# EAGLE design FORCE_SENSOR (EAGLE 7.1.0)
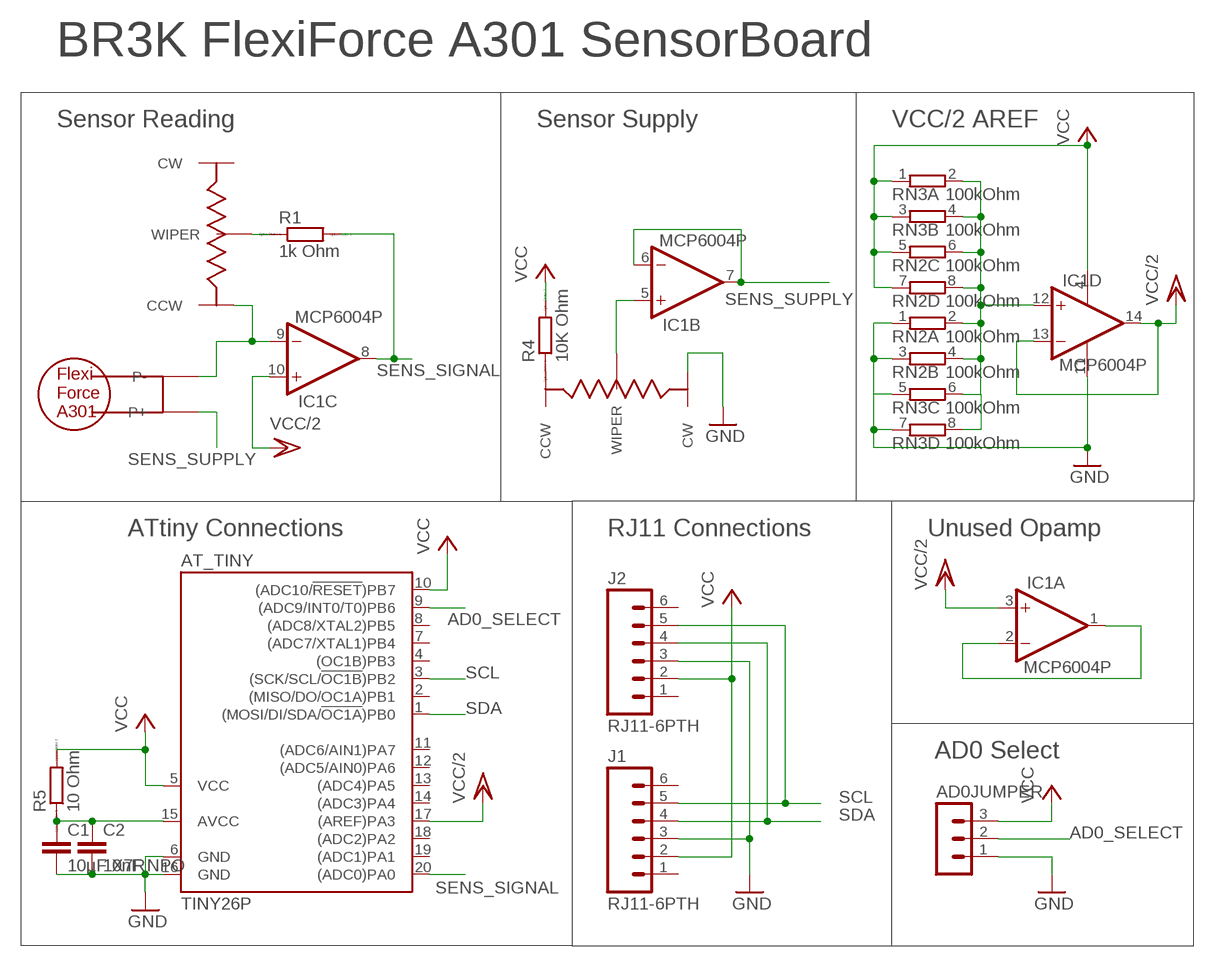
[diagram p0: schematic, sheet 1]

## Parts
AD0JUMPER  MA03-1  [MA03-1]
AT_TINY  TINY26P  [DIL20]
C1  10µF X7R  C5/2.5  [C5B2.5]
C2  10nF NPO  C5/2.5  [C5B2.5]
IC1  MCP6004P  [DIL14]
J1  RJ11-6PTH  [RJ11-6]
J2  RJ11-6PTH  [RJ11-6]
R1  1k Ohm  R-EU_0207_10  [0207/10]
R4  10K Ohm  R-EU_0207_10  [0207/10]
R5  10 Ohm  R-EU_0207_10  [0207/10]
RN2  100kOhm  E4R  [SIL8]
RN3  100kOhm  E4R  [SIL8]
U$1  FLEXI_FORCE_A301  [FLEXIFORCE_W237-102]
U$2  100k Ohm  TRIMMER_3296  [VERT_TRIMPOT]
U$3  10k Ohm  TRIMMER_3296  [VERT_TRIMPOT]

## Nets
AD0_SELECT: AD0JUMPER.2 AT_TINY.9((ADC9/INT0/T0)PB6)
GND: AD0JUMPER.1 AT_TINY.6(GND) AT_TINY.16(GND) C1.2 C2.2 IC1.11(P:V-) J1.3 J2.3 RN2.1 RN2.3 RN3.5 RN3.7 U$3.CW
N$1: R4.1 U$3.CCW
N$3: IC1.5(B:+IN) U$3.WIP(WIPER)
N$4: R1.1 U$2.WIP(WIPER)
N$5: IC1.9(C:-IN) U$1.2(P-) U$2.CCW
N$6: IC1.1(A:OUT) IC1.2(A:-IN)
N$9: AT_TINY.15(AVCC) C1.1 C2.1 R5.1
N$11: IC1.12(D:+IN) RN2.2 RN2.4 RN2.6 RN2.8 RN3.2 RN3.4 RN3.6 RN3.8
SCL: AT_TINY.3((SCK/SCL/!OC1B!)PB2) J1.5 J2.5
SDA: AT_TINY.1((MOSI/DI/SDA/!OC1A!)PB0) J1.4 J2.4
SENS_SIGNAL: AT_TINY.20((ADC0)PA0) IC1.8(C:OUT) R1.2
SENS_SUPPLY: IC1.6(B:-IN) IC1.7(B:OUT) U$1.1(P+)
VCC: AD0JUMPER.3 AT_TINY.5(VCC) AT_TINY.10((ADC10/!RESET!)PB7) IC1.4(P:V+) J1.2 J2.2 R4.2 R5.2 RN2.5 RN2.7 RN3.1 RN3.3
VCC/2: AT_TINY.17((AREF)PA3) IC1.3(A:+IN) IC1.10(C:+IN) IC1.13(D:-IN) IC1.14(D:OUT)
Unconnected: AT_TINY.2((MISO/DO/OC1A)PB1) AT_TINY.4((OC1B)PB3) AT_TINY.7((ADC7/XTAL1)PB4) AT_TINY.8((ADC8/XTAL2)PB5) AT_TINY.11((ADC6/AIN1)PA7) AT_TINY.12((ADC5/AIN0)PA6) AT_TINY.13((ADC4)PA5) AT_TINY.14((ADC3)PA4) AT_TINY.18((ADC2)PA2) AT_TINY.19((ADC1)PA1) J1.1 J1.6 J2.1 J2.6 U$2.CW

## Notes on the sheet
- BR3K FlexiForce A301 SensorBoard
- Sensor Reading | Sensor Supply | VCC/2 AREF
- ATtiny Connections | RJ11 Connections | Unused Opamp
- AD0 Select

## Library data of the parts
AD0JUMPER = con-lstb:MA03-1: PIN HEADER; OC_FARNELL: unknown; OC_NEWARK: unknown
AT_TINY = atmel:TINY26*: 8-bit AVR Microcontroller with 2K Bytes Flash Source: http://www.atmel.com .. doc1477.pdf; MPN: ATTINY261-20PU; OC_FARNELL: 1455146; OC_NEWARK: 58M3782
C1 C2 = capacitor-wima:C: CAPACITOR naming: grid - package width
IC1 = BodyRockParts:MCP6004: Quad Op Amp 1.8V to 6.0V Single Supply CMOS Source: http://ww1.microchip.com/downloads/en/DeviceDoc/21733j.pdf
J1 J2 = BodyRockParts:RJ11-6: RJ11 Jack Simple 6 pin RJ11 jack. Commonly found on CAT3 devices and Microchip programmers. SKU: PRT-00132
R1 R4 R5 = resistor:R-EU_: RESISTOR, European symbol; SPICEPREFIX: R
RN2 RN3 = resistor-sil:E4R: SIL RESISTOR; OC_FARNELL: unknown; OC_NEWARK: unknown
U$1 = BodyRockParts:FLEXI_FORCE_A301: Flexiforce A301 connected through a screw terminal
U$2 U$3 = BodyRockParts:TRIMMER_3296: TRIMMER 3296 25 turn vertical precision potmeter

## Board
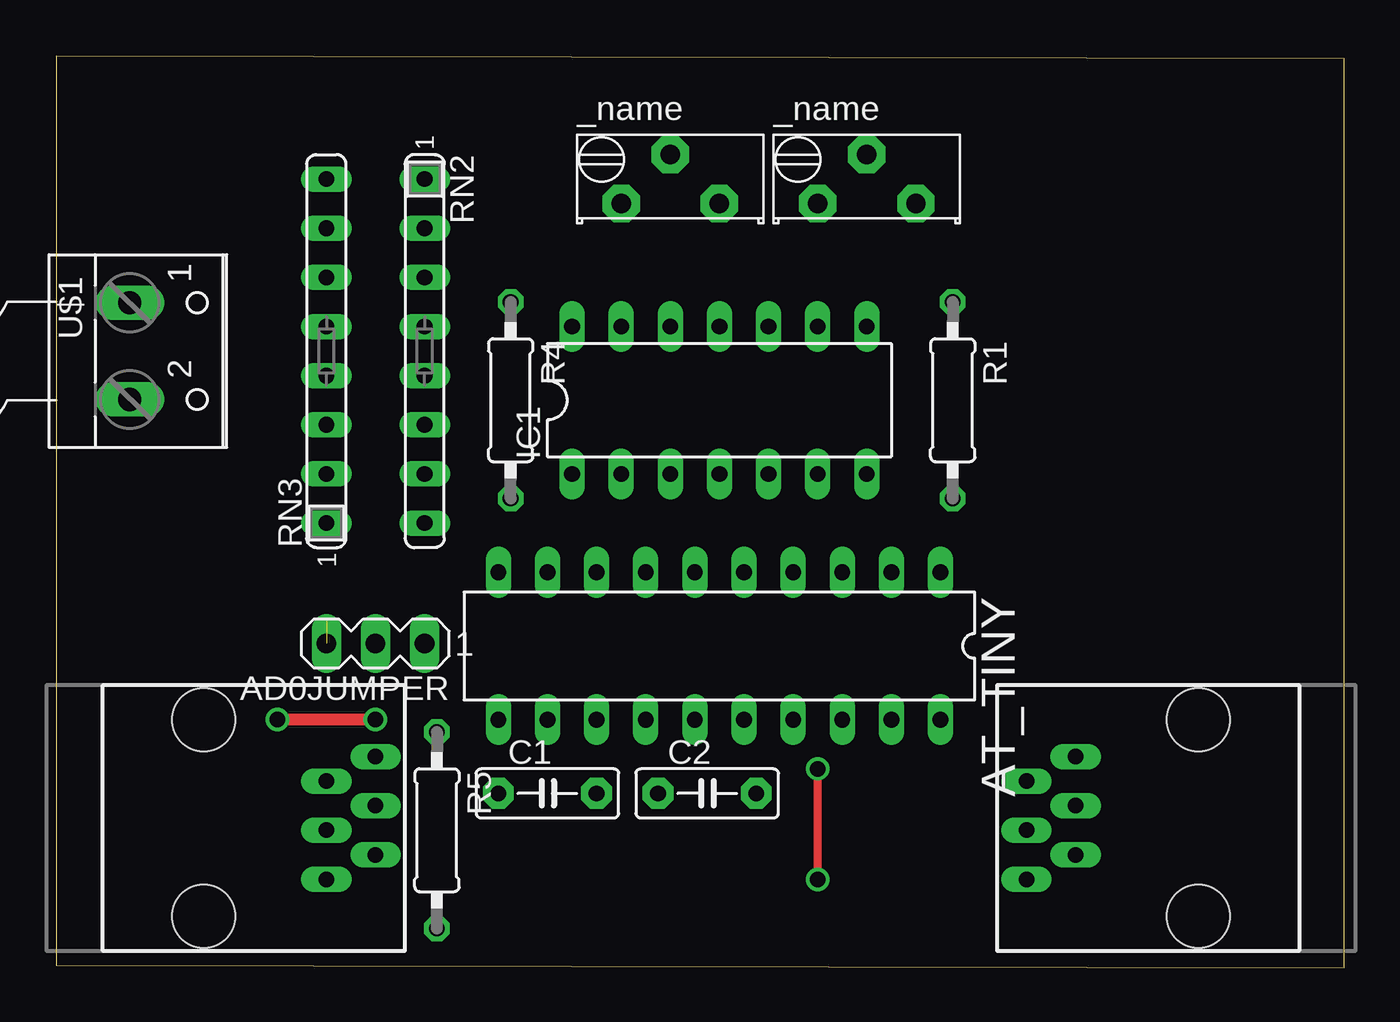
[diagram p1: board, top side]
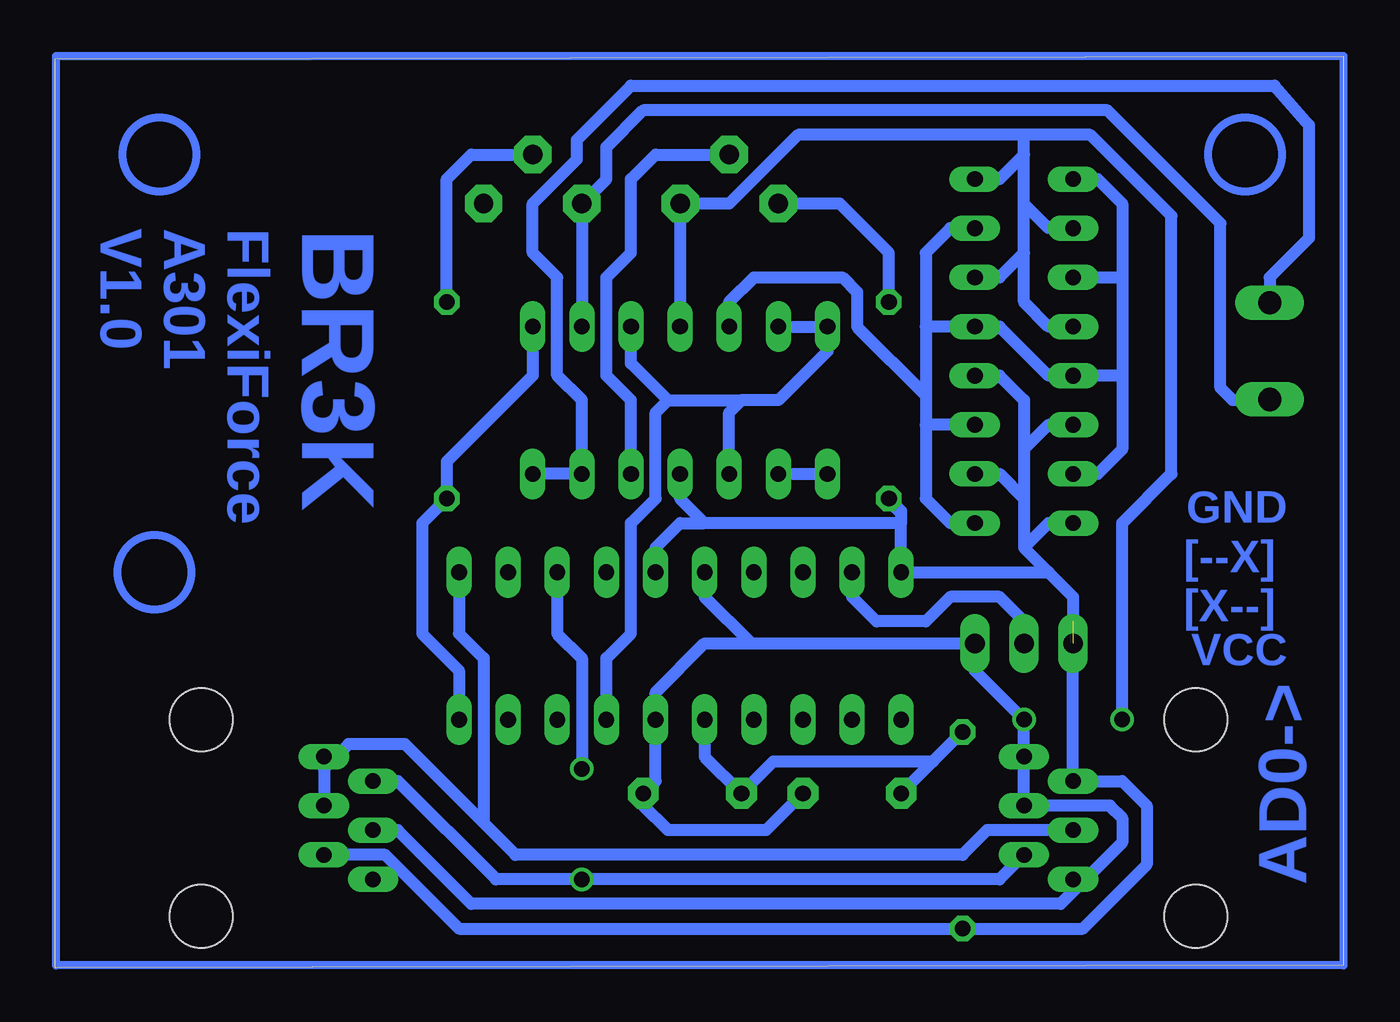
[diagram p2: board, bottom side, seen from below]

Size 66.6 x 47.11 mm. Coordinates in mm from the lower left corner, seen from the top.
Outline: 0,0.13 66.6,0 66.6,46.98 0,47.11 0,0.13
Copper layers (1*16): Top 0.035mm / dielectric 1.5mm / Bottom 0.035mm
Design rules "default *": minimum track width 10mil, minimum drill 24mil, track to track 12mil, track to pad 12mil, pad to pad 12mil, via to via 12mil, smd to smd 12mil, copper to edge 40mil, drill to drill 8mil, minimum pad ring 10mil, minimum via ring 8mil, stop-mask expansion 4mil, vias tented up to drill 0mil, thermal gap 10mil

### Footprints (pad centres in the part's own frame; a part is rotated, then mirrored left to right if it is on the bottom)
MA03-1 = drill 1.016 long: 1 -2.54,0; 2 0,0; 3 2.54,0
DIL20 = drill 0.813 long: 1 -11.43,-3.81; 2 -8.89,-3.81; 3 -6.35,-3.81; 4 -3.81,-3.81; 5 -1.27,-3.81; 6 1.27,-3.81; 7 3.81,-3.81; 8 6.35,-3.81; 9 8.89,-3.81; 10 11.43,-3.81; 11 11.43,3.81; 12 8.89,3.81; 13 6.35,3.81; 14 3.81,3.81; 15 1.27,3.81; 16 -1.27,3.81; 17 -3.81,3.81; 18 -6.35,3.81; 19 -8.89,3.81; 20 -11.43,3.81
C5B2.5 = drill 0.813 pad 1.6 octagon: 1 -2.54,0; 2 2.54,0
DIL14 = drill 0.813 long: 1 -7.62,-3.81; 2 -5.08,-3.81; 3 -2.54,-3.81; 4 0,-3.81; 5 2.54,-3.81; 6 5.08,-3.81; 7 7.62,-3.81; 8 7.62,3.81; 9 5.08,3.81; 10 2.54,3.81; 11 0,3.81; 12 -2.54,3.81; 13 -5.08,3.81; 14 -7.62,3.81
RJ11-6 = drill 0.8 long: 1 1.905,8.89; 2 3.175,6.35; 3 4.445,8.89; 4 5.715,6.35; 5 6.985,8.89; 6 8.255,6.35 | hole 3.251: 0,0; 10.16,0
0207/10 = drill 0.813 octagon: 1 -5.08,0; 2 5.08,0
SIL8 = drill 0.813 long: 1 -8.89,0; 2 -6.35,0; 3 -3.81,0; 4 -1.27,0; 5 1.27,0; 6 3.81,0; 7 6.35,0; 8 8.89,0
FLEXIFORCE_W237-102 = drill 1.194 long: 1 -2.5,-1.27; 2 2.5,-1.27
VERT_TRIMPOT = drill 1 pad 1.93 octagon: CCW 0,0; CW 5.08,0; WIP 2.54,2.54

### Placement (x,y rotation side)
AD0JUMPER  16.51,16.76 180 top
AT_TINY  34.29,16.64 180 top
C1  25.4,9.02 0 top
C2  33.66,9.02 0 top
IC1  34.29,29.34 0 top
J1  7.62,12.83 270 top
J2  59.05,2.67 90 top
R1  46.36,29.34 270 top
R4  23.5,29.34 270 top
R5  19.69,7.11 270 top
RN2  19.05,31.88 270 top
RN3  13.97,31.88 90 top
U$1  5.08,31.88 270 top
U$2  39.37,39.5 0 top
U$3  29.21,39.5 0 top

### Tracks (layer width: path | path; a pad name or v marks a point on that pad's centre or on a via)
AD0_SELECT
  Bottom 0.61: AD0JUMPER.2 16.51,17.91 17.78,19.18 20.32,19.18 21.59,17.91 24.13,17.91 25.4,19.18 AT_TINY.9
GND  (via drill 0.8)
  Top 0.61: v16.51,12.83 v11.43,12.83
  Bottom 0.61: J2.3 48.9,7.11 45.09,3.3 14.61,3.3 11.43,6.48 11.43,7.75 12.07,8.38 J1.3 v16.51,12.83 19.05,15.37 AD0JUMPER.1 | C1.2 29.84,7.11 34.93,7.11 36.2,8.38 C2.2 35.56,9.65 AT_TINY.16 35.56,14.22 33.02,16.76 AD0JUMPER.1 | IC1.11 U$3.CW 31.75,39.5 28.19,43.05 16.51,43.05 | RN3.5 15.24,33.15 16.51,34.42 16.51,36.96 | 16.51,36.96 16.51,39.5 | 16.51,39.5 16.51,42.04 | 16.51,42.04 16.51,43.05 | RN2.3 17.78,35.69 16.51,36.96 | RN3.7 15.24,38.23 16.51,39.5 | RN2.1 17.78,40.77 16.51,42.04 | AT_TINY.6 33.02,19.18 30.61,16.76 AD0JUMPER.1 | v11.43,12.83 11.43,22.99 8.89,25.53 8.89,38.86 13.08,43.05 16.51,43.05
N$1
  Bottom 0.61: R4.1 23.5,36.96 26.04,39.5 U$3.CCW
N$3
  Bottom 0.61: IC1.5 36.83,29.34 38.1,30.61 38.1,35.69 36.83,36.96 36.83,40.77 35.56,42.04 U$3.WIP
N$4
  Bottom 0.61: R1.1 46.36,40.77 45.09,42.04 U$2.WIP
N$5
  Bottom 0.406: 3.81,29.34 U$1.2
  Bottom 0.61: IC1.9 U$2.CCW 38.1,40.77 38.1,42.42 36.2,44.32 12.19,44.32 6.35,38.48 6.35,29.97 5.72,29.34 5.08,29.34 | 5.04,29.38 5.08,29.34 | 3.81,29.34 5.08,29.34
N$6
  Bottom 0.61: IC1.2 IC1.1
N$7
  Bottom 0.406: 0,47.12 0,0.13 66.55,0.13 66.55,47.12 0,47.12
N$9
  Bottom 0.61: 21.21,10.67 29.46,10.67 C2.1 33.02,10.92 AT_TINY.15 | 21.21,10.67 C1.1 | R5.1 21.21,10.67
N$11
  Bottom 0.61: 11.43,35.69 11.43,30.61 | 11.43,30.61 11.43,26.8 12.7,25.53 RN3.2 | RN3.6 11.43,35.69 | RN2.2 20.32,38.23 21.59,36.96 21.59,33.15 | 21.59,33.15 21.59,29.59 | 21.59,29.59 21.59,28.07 | 21.59,28.07 21.59,24.26 20.32,22.99 RN2.8 | RN2.6 21.59,28.07 | 21.59,33.15 RN2.4 17.78,33.15 15.24,30.61 RN3.4 11.43,30.61 | IC1.12 31.75,34.42 30.48,35.69 25.91,35.69 25.15,34.92 25.15,33.15 21.59,29.59 | RN3.8 12.7,40.77 11.43,39.5 11.43,35.69
SCL  (via drill 0.8)
  Top 0.406: v39.37,10.29 v39.37,4.57
  Bottom 0.61: J2.5 48.9,9.65 43.81,4.57 v39.37,4.57 17.78,4.57 J1.5 | AT_TINY.3 40.64,17.27 39.37,16 v39.37,10.29
SDA
  Bottom 0.61: AT_TINY.1 45.72,17.27 44.45,16 44.45,7.49 | 44.45,7.49 48.51,11.56 51.44,11.56 52.7,10.29 J2.4 | 44.45,7.49 42.8,5.84 19.69,5.84 18.41,7.11 J1.4
SENS_SIGNAL
  Bottom 0.61: IC1.8 41.91,30.61 46.36,26.16 R1.2 47.62,22.99 47.62,17.27 45.72,15.37 AT_TINY.20
SENS_SUPPLY
  Bottom 0.61: IC1.7 IC1.6 39.37,29.34 40.64,30.61 40.64,35.69 41.91,36.96 41.91,39.5 39.62,41.78 39.62,42.8 36.83,45.59 3.56,45.59 1.78,43.56 1.78,37.72 3.81,35.69 U$1.1
VCC  (1 unrouted)
  Bottom 0.61: J2.2 49.53,5.84 45.72,2.03 R5.2 13.46,2.03 10.16,5.33 10.16,8.38 11.43,9.65 J1.2 13.97,17.91 | RN2.5 17.78,30.61 16.51,29.34 16.51,26.8 | 16.51,26.8 16.51,24.26 | 16.51,24.26 16.51,21.72 | 16.51,21.72 15.24,22.99 RN3.1 | RN3.3 15.24,28.07 16.51,26.8 | RN2.7 17.78,25.53 16.51,24.26 | 16.51,21.72 15.24,20.45 | 15.24,20.45 13.97,19.18 AD0JUMPER.3 | 15.24,20.45 AT_TINY.10 22.86,22.99 | 22.86,23.49 22.86,23.62 R4.2 23.5,24.13 22.86,23.49 | 22.86,23.49 22.86,22.99 | 22.86,22.99 33.02,22.99 | 33.02,22.99 34.29,24.26 IC1.4 | AT_TINY.5 35.56,21.72 34.29,22.99 33.02,22.99
VCC/2
  Bottom 0.61: IC1.3 31.75,28.7 31.12,29.34 | 34.93,29.34 35.56,28.7 35.56,24.26 36.83,22.99 36.83,17.27 38.1,16 AT_TINY.17 | 34.93,29.34 31.12,29.34 | 34.93,29.34 36.83,31.24 IC1.10 | IC1.13 IC1.14 26.67,31.88 29.21,29.34 31.12,29.34
(copper drawn outside any net)
  shapes: Bottom circle x7

### Text on the board
Bottom: BR3K | FlexiForce / A301 / V1.0 | GND | [--X] / [X--] | VCC | AD0->